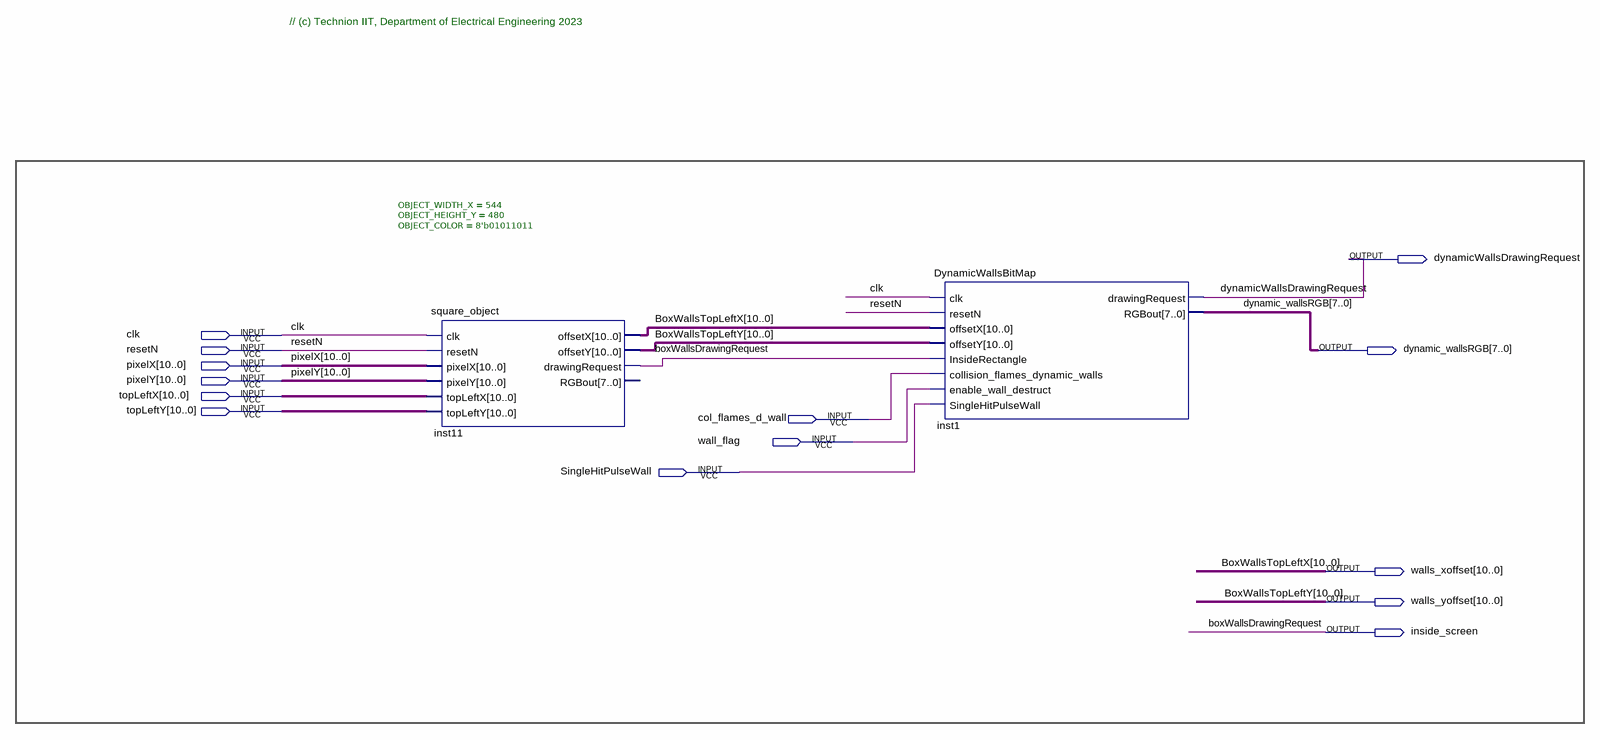
[diagram p0: schematic sheet]
// Quartus schematic DYNAMICWALLS_DISPLAY.bdf as structural Verilog: 2 symbols, 14 pins
module DYNAMICWALLS_DISPLAY (
  input  clk,
  input  resetN,
  input  [10:0] pixelX,
  input  [10:0] pixelY,
  input  [10:0] topLeftX,
  input  [10:0] topLeftY,
  input  col_flames_d_wall,
  input  wall_flag,
  input  SingleHitPulseWall,
  output dynamicWallsDrawingRequest,
  output [7:0] dynamic_wallsRGB,
  output [10:0] walls_xoffset,
  output [10:0] walls_yoffset,
  output inside_screen
);

  square_object #(.OBJECT_WIDTH_X(544), .OBJECT_HEIGHT_Y(480), .OBJECT_COLOR(8'b01011011)) inst11 (
    .clk(clk), .resetN(resetN), .pixelX(pixelX), .pixelY(pixelY), .topLeftX(topLeftX), .topLeftY(topLeftY),
    .offsetX(walls_xoffset), .offsetY(walls_yoffset), .drawingRequest(inside_screen));  // open: RGBout
  DynamicWallsBitMap inst1 (
    .clk(clk), .resetN(resetN), .offsetX(walls_xoffset), .offsetY(walls_yoffset),
    .InsideRectangle(inside_screen), .collision_flames_dynamic_walls(col_flames_d_wall),
    .enable_wall_destruct(wall_flag), .SingleHitPulseWall(SingleHitPulseWall),
    .drawingRequest(dynamicWallsDrawingRequest), .RGBout(dynamic_wallsRGB));

  // Other names for the same wires on the sheet: boxWallsDrawingRequest = inside_screen;
  //   BoxWallsTopLeftX[10:0] = walls_xoffset; BoxWallsTopLeftY[10:0] = walls_yoffset

  // Notes on the sheet:
  //   // (c) Technion IIT, Department of Electrical Engineering 2023
endmodule
